# EAGLE design uHost (EAGLE 7.2.0)
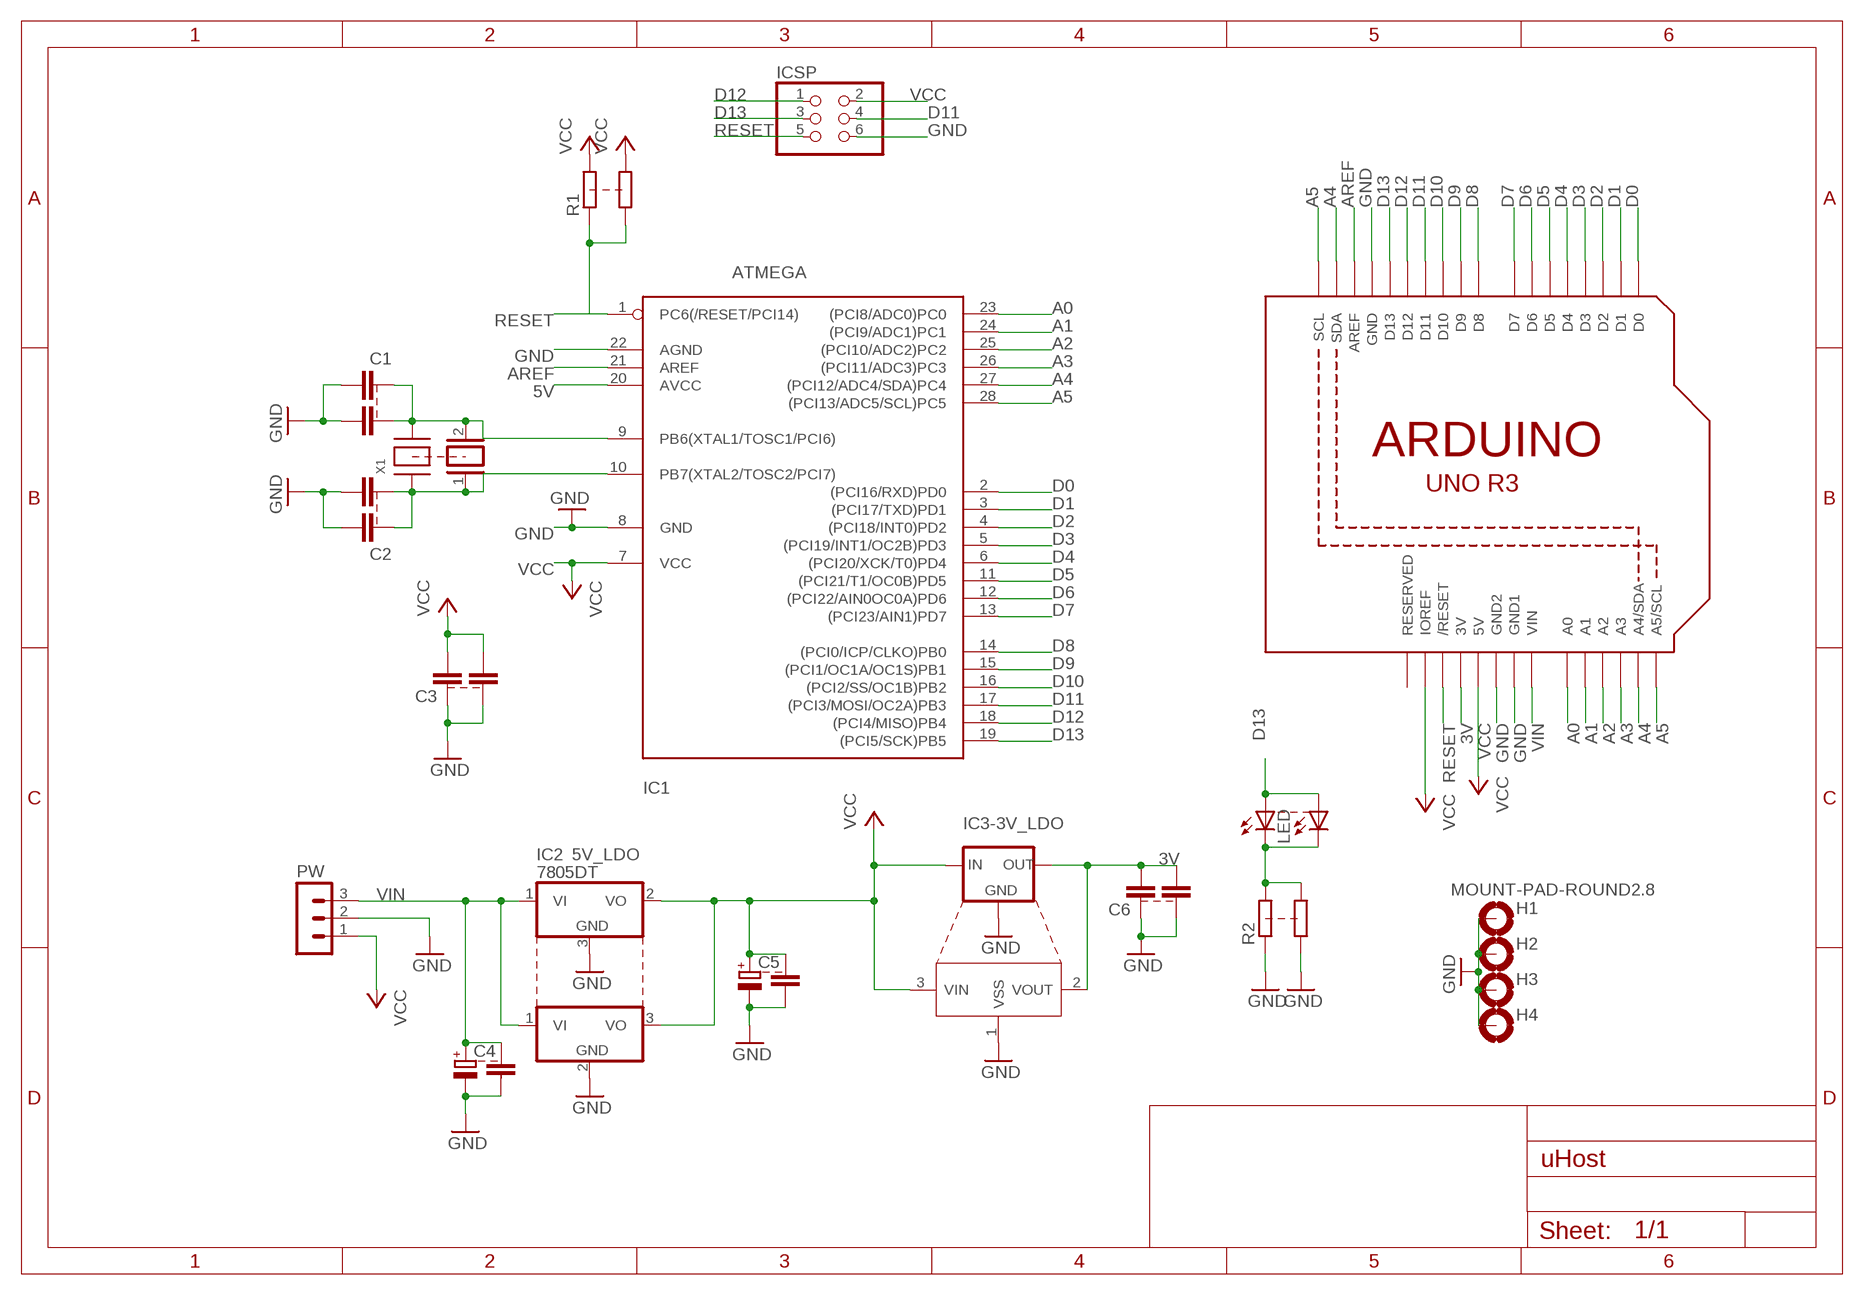
[diagram p0: schematic, sheet 1]

## Parts
C1  C-EUC1206  [C1206]
C2  C-EUC1206  [C1206]
C3  C-EU050-025X075  [C050-025X075]
C4  CPOL-EUE2.5-6  [E2,5-6]
C5  CPOL-EUE2.5-6  [E2,5-6]
C6  C-EU050-025X075  [C050-025X075]
C21  C-EU050-025X075  [C050-025X075]
C22  C-EU050-025X075  [C050-025X075]
C23  C-EUC1206  [C1206]
C24  C-EUC1206  [C1206]
C25  C-EUC1206  [C1206]
C26  C-EUC1206  [C1206]
H1  MOUNT-PAD-ROUND2.8  [2,8-PAD]
H2  MOUNT-PAD-ROUND2.8  [2,8-PAD]
H3  MOUNT-PAD-ROUND2.8  [2,8-PAD]
H4  MOUNT-PAD-ROUND2.8  [2,8-PAD]
IC1  ATMEGA  ATMEGA168-20P  [DIL28-3]
IC2  7805DT  [TO252]
IC3-3V_LDO  78LXX  [78LXX]
IC23  5V_LDO  7805T  [TO220H]
ICSP  PINHD-2X3  [2X03]
LED  LED3MM  [LED3MM]
LED1  LEDCHIPLED_1206  [CHIPLED_1206]
PW  MA03-1  [MA03-1]
Q2  XTAL/S  [QS]
R1  R-EU_0207/7  [0207/7]
R2  R-EU_0207/7  [0207/7]
R21  R-EU_R1206  [R1206]
R22  R-EU_R1206  [R1206]
U1  ARDUINOR3-BPLACE  [ARDUINOR3-BPLACE]
U2  XC6206-3.3-1300260P1  [SOT23]
X1  XTALNX5032  [NX5032]

## Nets
3V: C6.2 C26.2 IC3-3V_LDO.OUT U1.3V U2.2(VOUT)
5V: IC1.20(AVCC)
A0: IC1.23((PCI8/ADC0)PC0) U1.A0
A1: IC1.24((PCI9/ADC1)PC1) U1.A1
A2: IC1.25((PCI10/ADC2)PC2) U1.A2
A3: IC1.26((PCI11/ADC3)PC3) U1.A3
A4: IC1.27((PCI12/ADC4/SDA)PC4) U1.A4(A4/SDA) U1.SDA
A5: IC1.28((PCI13/ADC5/SCL)PC5) U1.A5(A5/SCL) U1.SCL
AREF: IC1.21(AREF) U1.AREF
D0: IC1.2((PCI16/RXD)PD0) U1.D0
D1: IC1.3((PCI17/TXD)PD1) U1.D1
D2: IC1.4((PCI18/INT0)PD2) U1.D2
D3: IC1.5((PCI19/INT1/OC2B)PD3) U1.D3
D4: IC1.6((PCI20/XCK/T0)PD4) U1.D4
D5: IC1.11((PCI21/T1/OC0B)PD5) U1.D5
D6: IC1.12((PCI22/AIN0OC0A)PD6) U1.D6
D7: IC1.13((PCI23/AIN1)PD7) U1.D7
D8: IC1.14((PCI0/ICP/CLKO)PB0) U1.D8
D9: IC1.15((PCI1/OC1A/OC1S)PB1) U1.D9
D10: IC1.16((PCI2/SS/OC1B)PB2) U1.D10
D11: IC1.17((PCI3/MOSI/OC2A)PB3) ICSP.4 U1.D11
D12: IC1.18((PCI4/MISO)PB4) ICSP.1 U1.D12
D13: IC1.19((PCI5/SCK)PB5) ICSP.3 LED1.A LED.A U1.D13
GND: C1.2 C2.2 C3.1 C4.- C5.- C6.1 C21.2 C22.2 C23.1 C24.2 C25.2 C26.1 H1.B2,8(MOUNT) H2.B2,8(MOUNT) H3.B2,8(MOUNT) H4.B2,8(MOUNT) IC1.8(GND) IC1.22(AGND) IC2.3(GND) IC3-3V_LDO.GND IC23.2(GND) ICSP.6 PW.2 R2.1 R22.1 U1.GND U1.GND1 U1.GND2 U2.1(VSS)
N$2: LED1.C LED.K(C) R2.2 R22.2
N$33: C1.1 C21.1 IC1.9(PB6(XTAL1/TOSC1/PCI6)) Q2.2 X1.P$2
N$34: C2.1 C22.1 IC1.10(PB7(XTAL2/TOSC2/PCI7)) Q2.1 X1.P$1
RESET: IC1.1(PC6(/RESET/PCI14)) ICSP.5 R1.1 R21.1 U1.RESET(/RESET)
VCC: C3.2 C5.+ C23.2 C25.1 IC1.7(VCC) IC2.2(VO) IC3-3V_LDO.IN IC23.3(VO) ICSP.2 PW.1 R1.2 R21.2 U1.5V U1.IOREF U2.3(VIN)
VIN: C4.+ C24.1 IC2.1(VI) IC23.1(VI) PW.3 U1.VIN
Unconnected: U1.RESERVED

## Library data of the parts
C1 C2 C23-C26 = rcl:C-EU: CAPACITOR, European symbol
C3 C6 C21 C22 = resistor:C-EU: CAPACITOR, European symbol
C4 C5 = rcl:CPOL-EU: POLARIZED CAPACITOR, European symbol
H1-H4 = holes:MOUNT-PAD-ROUND: MOUNTING PAD, round
IC1 = adafruit:ATMEGA168*P: MICROCONTROLLER 16 kBytes FLASH 1 kBytes SRAM 512 Bytes EEPROM USART 8-channel 10 bit ADC
IC2 IC23 = adafruit:78*: Positive VOLTAGE REGULATOR Added bigger pads to the TO-92 package
IC3-3V_LDO = v-reg:78LXX: VOLTAGE REGULATOR
ICSP = pinhead:PINHD-2X3: PIN HEADER
LED = adafruit:LED: LED
LED1 = led:LED: LED
PW = con-lstb:MA03-1: PIN HEADER; OC_FARNELL: unknown; OC_NEWARK: unknown
Q2 = special:XTAL/S: CRYSTAL
R1 R2 R21 R22 = resistor:R-EU_: RESISTOR, European symbol
U1 = adafruit:ARDUINOR3: This is a new object for the new Arduino R3 - with extra pins that you may want to use (such as IOref, and duplicated A4/A5
U2 = OPL:XC6206-3.3: LOW ESR Cap.Compatible Positive Voltage Regulators
X1 = adafruit:XTAL: Low cost SMT crystals, no capacitors included http://www.ladyada.net/library/eagle

## Board
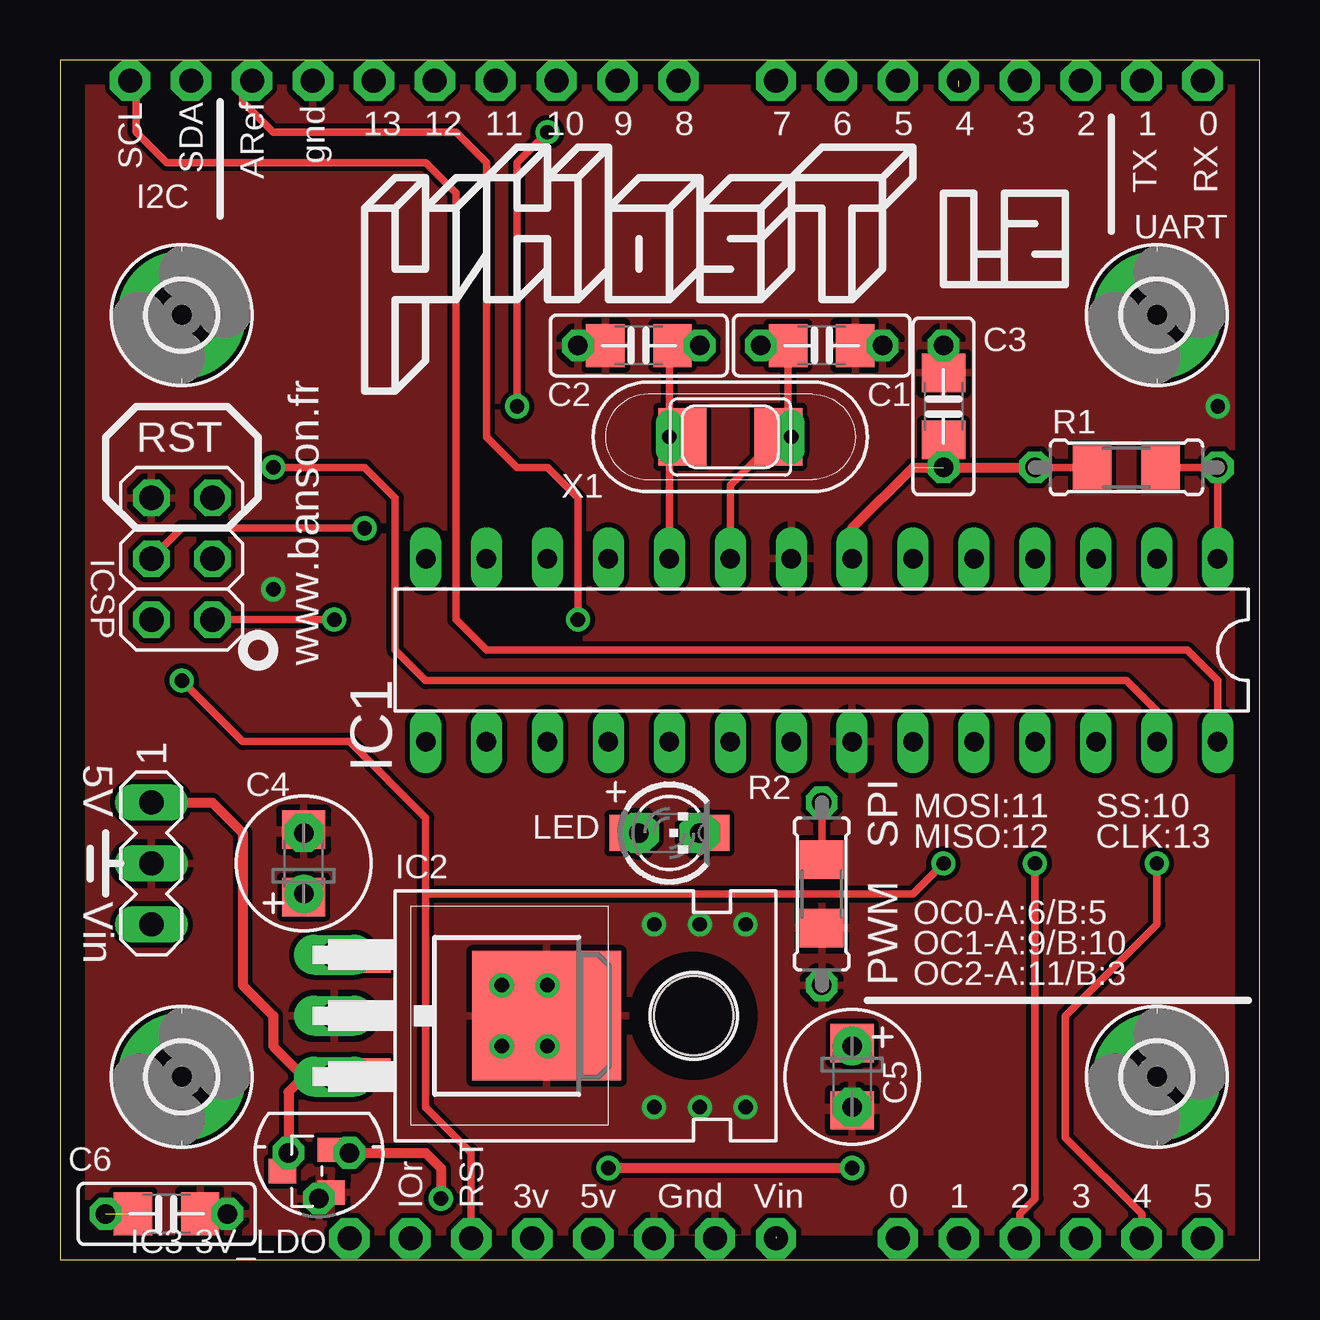
[diagram p1: board, top side]
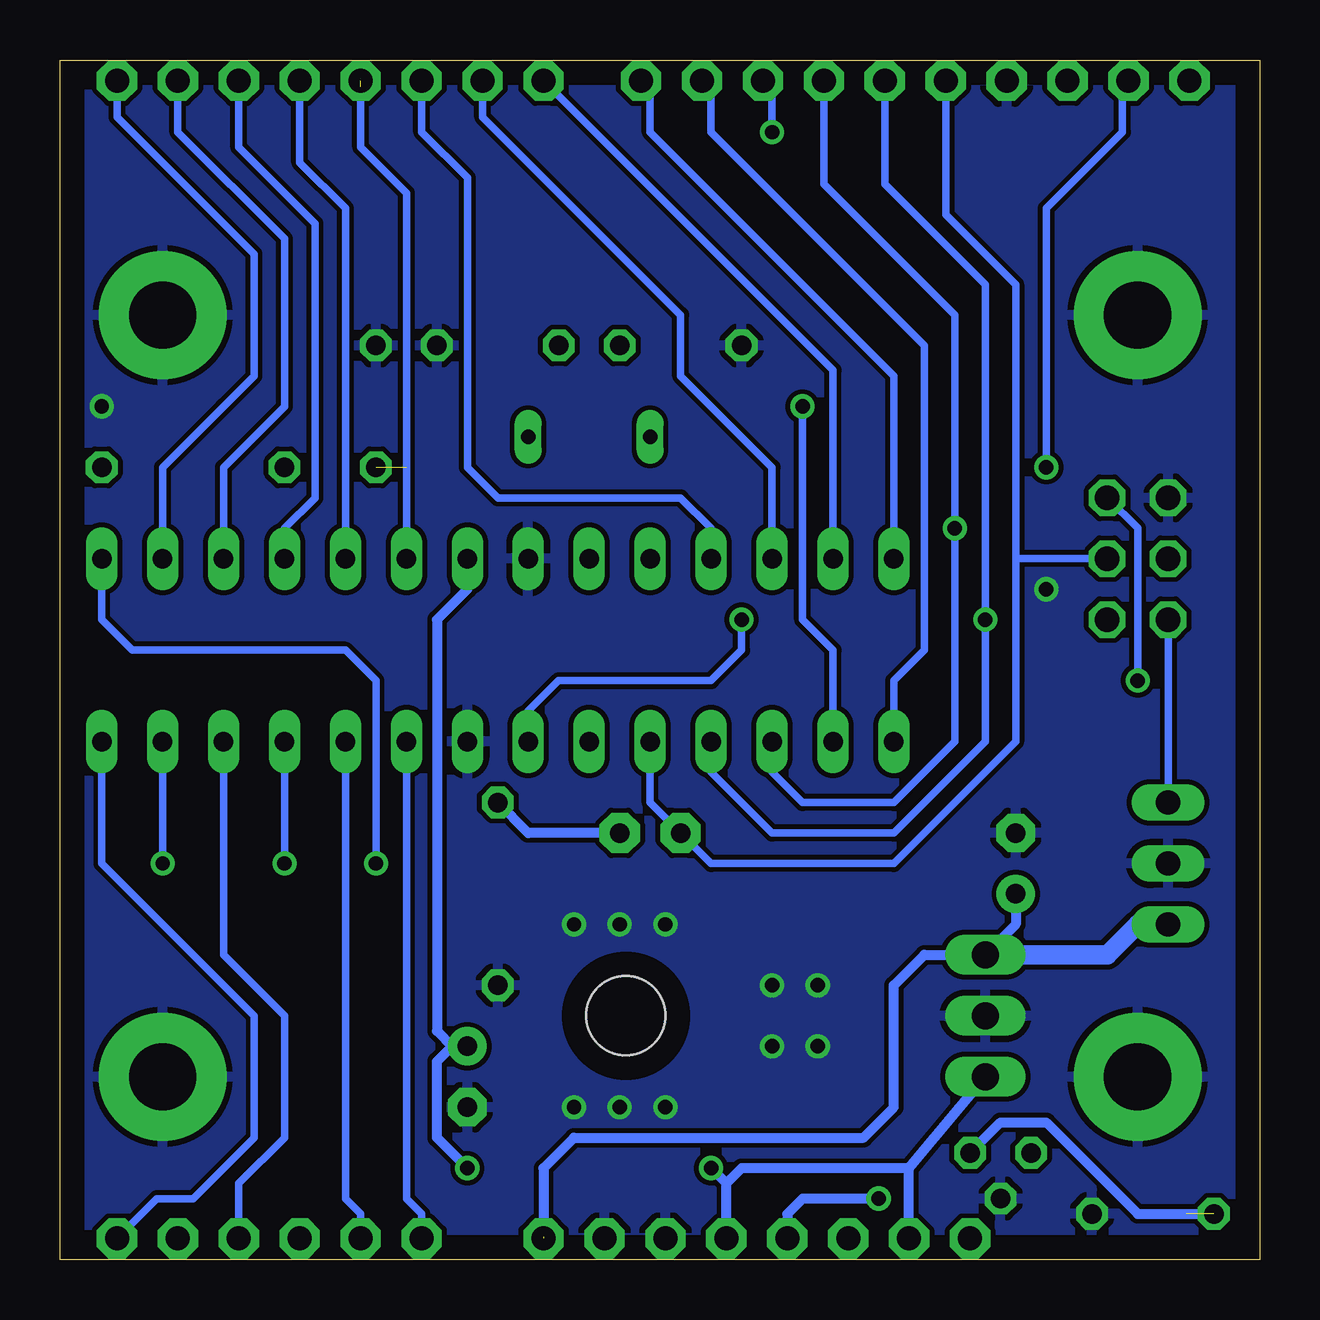
[diagram p2: board, bottom side, seen from below]

Size 50 x 50 mm. Coordinates in mm from the lower left corner, seen from the top.
Outline: 0,0 50,0 50,50 0,50 0,0
Copper layers (1*16): Top 0.035mm / dielectric 1.5mm / Bottom 0.035mm
Design rules "default": minimum track width 10mil, minimum drill 24mil, track to track 8mil, track to pad 8mil, pad to pad 8mil, via to via 8mil, smd to smd 8mil, copper to edge 40mil, drill to drill 8mil, minimum pad ring 10mil, minimum via ring 8mil, stop-mask expansion 4mil, vias tented up to drill 0mil, thermal gap 10mil

### Footprints (pad centres in the part's own frame; a part is rotated, then mirrored left to right if it is on the bottom)
C1206 = smd 1.6 x 1.8: 1 -1.4,0; 2 1.4,0
C050-025X075 = drill 0.813 octagon: 1 -2.54,0; 2 2.54,0
E2,5-6 = drill 0.813 pad 1.6: + -1.27,0 | drill 0.813 pad 1.6 octagon: - 1.27,0
2,8-PAD = drill 2.8 pad 5.334: B2,8 0,0
DIL28-3 = drill 0.813 long: 1 -16.51,-3.81; 2 -13.97,-3.81; 3 -11.43,-3.81; 4 -8.89,-3.81; 5 -6.35,-3.81; 6 -3.81,-3.81; 7 -1.27,-3.81; 8 1.27,-3.81; 9 3.81,-3.81; 10 6.35,-3.81; 11 8.89,-3.81; 12 11.43,-3.81; 13 13.97,-3.81; 14 16.51,-3.81; 15 16.51,3.81; 16 13.97,3.81; 17 11.43,3.81; 18 8.89,3.81; 19 6.35,3.81; 20 3.81,3.81; 21 1.27,3.81; 22 -1.27,3.81; 23 -3.81,3.81; 24 -6.35,3.81; 25 -8.89,3.81; 26 -11.43,3.81; 27 -13.97,3.81; 28 -16.51,3.81
TO252 = smd 1 x 1.6: 1 -2.28,-4.8; 2 2.28,-4.8 | smd 5.4 x 6.2: 3 0,2.5
78LXX = drill 0.813 octagon: GND 0,1.905; IN 1.27,0; OUT -1.27,0
TO220H = drill 1.118 long: 1 -2.54,-10.16; 2 0,-10.16; 3 2.54,-10.16 | hole 3.302: 0,4.826
2X03 = drill 1.016 octagon: 1 -2.54,-1.27; 2 -2.54,1.27; 3 0,-1.27; 4 0,1.27; 5 2.54,-1.27; 6 2.54,1.27
LED3MM = drill 0.813 pad 1.676 octagon: A -1.27,0; K 1.27,0
CHIPLED_1206 = smd 1.5 x 1.5: A 0,-1.75; C 0,1.75
MA03-1 = drill 1.016 long: 1 -2.54,0; 2 0,0; 3 2.54,0
QS = drill 0.61 long: 1 -2.54,0; 2 2.54,0
0207/7 = drill 0.813 octagon: 1 -3.81,0; 2 3.81,0
R1206 = smd 1.6 x 1.803: 1 -1.422,0; 2 1.422,0
ARDUINOR3-BPLACE = drill 1 pad 1.676 octagon: 3V 35.56,2.54; 5V 38.1,2.54; A0 50.8,2.54; A1 53.34,2.54; A2 55.88,2.54; A3 58.42,2.54; A4 60.96,2.54; A5 63.5,2.54; AREF 23.876,50.8; D0 63.5,50.8; D1 60.96,50.8; D2 58.42,50.8; D3 55.88,50.8; D4 53.34,50.8; D5 50.8,50.8; D6 48.26,50.8; D7 45.72,50.8; D8 41.656,50.8; D9 39.116,50.8; D10 36.576,50.8; D11 34.036,50.8; D12 31.496,50.8; D13 28.956,50.8; GND 26.416,50.8; GND1 43.18,2.54; GND2 40.64,2.54; IOREF 30.48,2.54; RESERVED 27.94,2.54; RESET 33.02,2.54; SCL 18.796,50.8; SDA 21.336,50.8; VIN 45.72,2.54
SOT23 = smd 1.016 x 1.143: 1 -0.889,-1.016; 2 0.889,-1.016; 3 0,1.016
NX5032 = smd 2 x 2.4: P$1 2,0; P$2 -2,0

### Placement (x,y rotation side)
C1  31.75,38.1 0 top
C2  24.13,38.1 180 top
C3  36.83,35.56 270 top
C4  10.16,16.51 90 top
C5  33.02,7.62 270 top
C6  4.45,1.91 180 top
C21  31.75,38.1 0 top
C22  24.13,38.1 180 top
C23  36.83,35.56 270 top
C24  10.16,16.51 90 top
C25  33.02,7.62 270 top
C26  4.45,1.91 180 top
H1  45.72,39.37 0 top
H2  45.72,7.62 0 top
H3  5.08,7.62 0 top
H4  5.08,39.37 0 top
IC1  31.75,25.4 180 top
IC2  17.78,10.16 270 top
IC3-3V_LDO  10.79,4.45 180 top
IC23  21.59,10.16 270 top
ICSP  5.08,29.21 90 top
LED  25.4,17.78 0 top
LED1  25.4,17.78 270 top
PW  3.81,16.51 270 top
Q2  27.94,34.29 0 top
R1  44.45,33.02 180 top
R2  31.75,15.24 90 top
R21  44.45,33.02 180 top
R22  31.75,15.24 90 top
U1  -15.88,-1.66 0 top
U2  10.29,3.68 90 top
X1  27.94,34.29 180 top

### Tracks (layer width: path | path; a pad name or v marks a point on that pad's centre or on a via)
3V  (via drill 0.6)  (1 unrouted)
  Top 0.406: v15.88,2.54 15.88,3.81 15.24,4.45 IC3-3V_LDO.OUT 12.06,4.38 U2.2
  Bottom 0.406: IC3-3V_LDO.OUT 10.79,5.71 8.89,5.71 5.08,1.91 C6.2 | v15.88,2.54 19.05,2.54 19.68,1.91 U1.3V
A0
  Bottom 0.305: U1.A0 34.92,1.91 35.56,2.54 IC1.23
A1
  Bottom 0.305: U1.A1 37.47,1.91 38.1,2.54 IC1.24
A2  (via drill 0.6)
  Top 0.305: U1.A2 40.01,1.91 40.64,2.54 v40.64,16.51
  Bottom 0.305: v40.64,16.51 IC1.25
A3
  Bottom 0.305: U1.A3 42.55,3.17 40.64,5.08 40.64,10.16 43.18,12.7 IC1.26
A4  (via drill 0.6)
  Top 0.305: U1.A4 45.09,1.91 41.91,5.08 41.91,10.16 45.72,13.97 v45.72,16.51 | IC1.27 45.72,22.86 44.45,24.13 15.24,24.13 13.97,25.4 13.97,31.75 12.7,33.02 v8.89,33.02
  Bottom 0.305: v8.89,33.02 8.89,43.81 5.71,46.99 5.71,48.88 U1.SDA | v45.72,16.51 IC1.27
A5
  Top 0.305: IC1.28 48.26,24.13 46.99,25.4 17.78,25.4 16.51,26.67 16.51,44.45 15.24,45.72 4.45,45.72 3.17,46.99 3.17,48.88 U1.SCL
  Bottom 0.305: IC1.28 48.26,16.51 41.91,10.16 41.91,5.08 44.45,2.54 45.96,2.54 U1.A5
AREF  (via drill 0.6)
  Top 0.305: v21.59,26.67 21.59,31.75 20.32,33.02 19.05,33.02 17.78,34.29 17.78,45.72 16.51,46.99 8.89,46.99 7.62,48.26 7.62,48.76 U1.AREF
  Bottom 0.305: IC1.21 30.48,22.86 29.21,24.13 22.86,24.13 21.59,25.4 v21.59,26.67
D0
  Bottom 0.305: U1.D0 47.62,47.62 41.91,41.91 41.91,36.83 43.18,35.56 45.72,33.02 IC1.2
D1
  Bottom 0.305: IC1.3 43.18,33.02 40.64,35.56 40.64,42.55 45.09,46.99 U1.D1
D2
  Bottom 0.305: IC1.4 40.64,30.48 39.37,31.75 39.37,43.18 42.55,46.35 U1.D2
D3
  Bottom 0.305: IC1.5 38.1,43.81 40.01,45.72 U1.D3
D4  (1 unrouted)
  Bottom 0.305: IC1.6 35.56,44.45 37.47,46.35 37.47,48.9
D5
  Bottom 0.305: IC1.11 22.86,30.48 24.13,31.75 31.75,31.75 33.02,33.02 33.02,45.09 34.92,46.99 U1.D5
D6
  Bottom 0.305: IC1.12 20.32,33.02 24.13,36.83 24.13,39.37 32.38,47.62 U1.D6
D7
  Bottom 0.305: IC1.13 17.78,37.07 U1.D7
D8
  Bottom 0.305: IC1.14 15.24,36.83 25.4,46.99 25.4,48.76 U1.D8
D9
  Bottom 0.305: IC1.15 15.24,24.13 13.97,25.4 13.97,38.1 22.86,46.99 22.86,48.76 U1.D9
D10  (via drill 0.6)
  Top 0.305: v19.05,35.56 19.05,45.72 v20.32,46.99
  Bottom 0.305: IC1.16 17.78,25.4 19.05,26.67 v19.05,35.56 | v20.32,46.99 20.32,48.76 U1.D10
D11  (via drill 0.6)
  Top 0.305: ICSP.4 5.08,30.48 v12.7,30.48
  Bottom 0.305: U1.D11 18.16,44.83 12.7,39.37 v12.7,30.48 12.7,21.59 15.24,19.05 19.05,19.05 20.32,20.32 IC1.17
D12  (via drill 0.6)
  Top 0.305: ICSP.1 v11.43,26.67
  Bottom 0.305: U1.D12 15.62,44.83 11.43,40.64 v11.43,26.67 11.43,21.59 15.24,17.78 20.32,17.78 22.86,20.32 IC1.18
D13
  Top 0.305: LED1.A 24.13,16.99 LED.A
  Bottom 0.305: U1.D13 13.08,43.56 10.16,40.64 10.16,29.21 | 10.16,29.21 10.16,21.59 15.24,16.51 22.86,16.51 LED.A 25.4,19.05 IC1.19 | ICSP.3 10.16,29.21
GND  (via drill 0.6)
  Top 0.305: C23.1 C3.1 | C1.2 C21.2 | C2.2 C22.2
  Top 0.406: U2.1 10.79,2.6 IC3-3V_LDO.GND
  other vias: 18.41,11.43 18.41,8.89 20.32,8.89 20.32,11.43 24.77,13.97 26.67,13.97 28.57,13.97 24.77,6.35 26.67,6.35 28.57,6.35 8.89,27.94 48.26,35.56
  pour Top: 0,49.53 0,0 49.53,0 49.53,49.53
  pour Bottom: 0,49.53 0,0 49.53,0 49.53,49.53
N$2
  Top 0.305: LED1.C 26.67,16.99 LED.K | R22.2 R2.2
  Bottom 0.406: LED.K 30.48,17.78 R2.2
N$33
  Top 0.305: C21.1 C1.1 30.35,34.42 Q2.2 X1.P$2 27.94,32.29 IC1.9
N$34
  Top 0.305: C22.1 C2.1 25.4,37.97 Q2.1 X1.P$1 25.4,33.75 IC1.10
RESET  (via drill 0.6)
  Top 0.305: R21.1 R1.1 IC1.1 | U1.RESET 17.14,4.45 15.24,6.35 15.24,15.24 | 15.24,15.24 15.24,18.41 12.06,21.59 7.62,21.59 v5.08,24.13 | 15.24,15.24 35.56,15.24 v36.83,16.51
  Bottom 0.305: v5.08,24.13 5.08,30.48 ICSP.5 | v36.83,16.51 36.83,24.13 38.1,25.4 46.99,25.4 48.26,26.67 IC1.1
VCC  (via drill 0.6)  (1 unrouted)
  Top 0.305: R21.2 R1.2 | C23.2 C3.2 | IC2.2 11.69,7.88 IC23.3
  Top 0.406: IC1.7 33.02,30.48 35.56,33.02 R1.2 | PW.1 6.35,19.05 7.62,17.78 7.62,11.43 8.89,10.16 8.89,8.89 10.16,7.62 | 10.16,7.62 IC23.3 | 10.16,7.62 9.53,6.99 IC3-3V_LDO.IN 9.53,3.49 U2.3 | C25.1 C5.+ | v33.02,3.81 v22.86,3.81
  Bottom 0.305: ICSP.2 PW.1
  Bottom 0.406: U1.5V 22.23,3.17 | v33.02,3.81 34.29,5.08 34.29,8.26 33.66,8.89 | IC1.7 33.02,27.94 34.29,26.67 34.29,9.53 33.66,8.89 | 33.66,8.89 C5.+ | U1.IOREF 14.61,3.81 | 14.61,3.81 21.59,3.81 22.23,3.17 | 14.61,3.81 IC23.3 | v22.86,3.81 22.23,3.17
VIN  (1 unrouted)
  Top 0.305: IC2.1 11.69,12.44 IC23.1
  Top 0.406: C24.1 C4.+
  Bottom 0.406: C4.+ 10.16,13.97 IC23.1 13.97,12.7 15.24,11.43 15.24,6.35 16.51,5.08 28.57,5.08 29.84,3.81 29.84,0.95
  Bottom 0.813: PW.3 5.08,13.97 6.35,12.7 IC23.1

### Text on the board
tPlace: I2C | TX | RX | UART | RST | www.banson.fr | 5V | MOSI:11 | SS:10 | SPI | MISO:12 | CLK:13 | Vin | OC0-A:6/B:5 | OC1-A:9/B:10 | PWM | OC2-A:11/B:3